# EAGLE design USB (EAGLE 7.1.0)
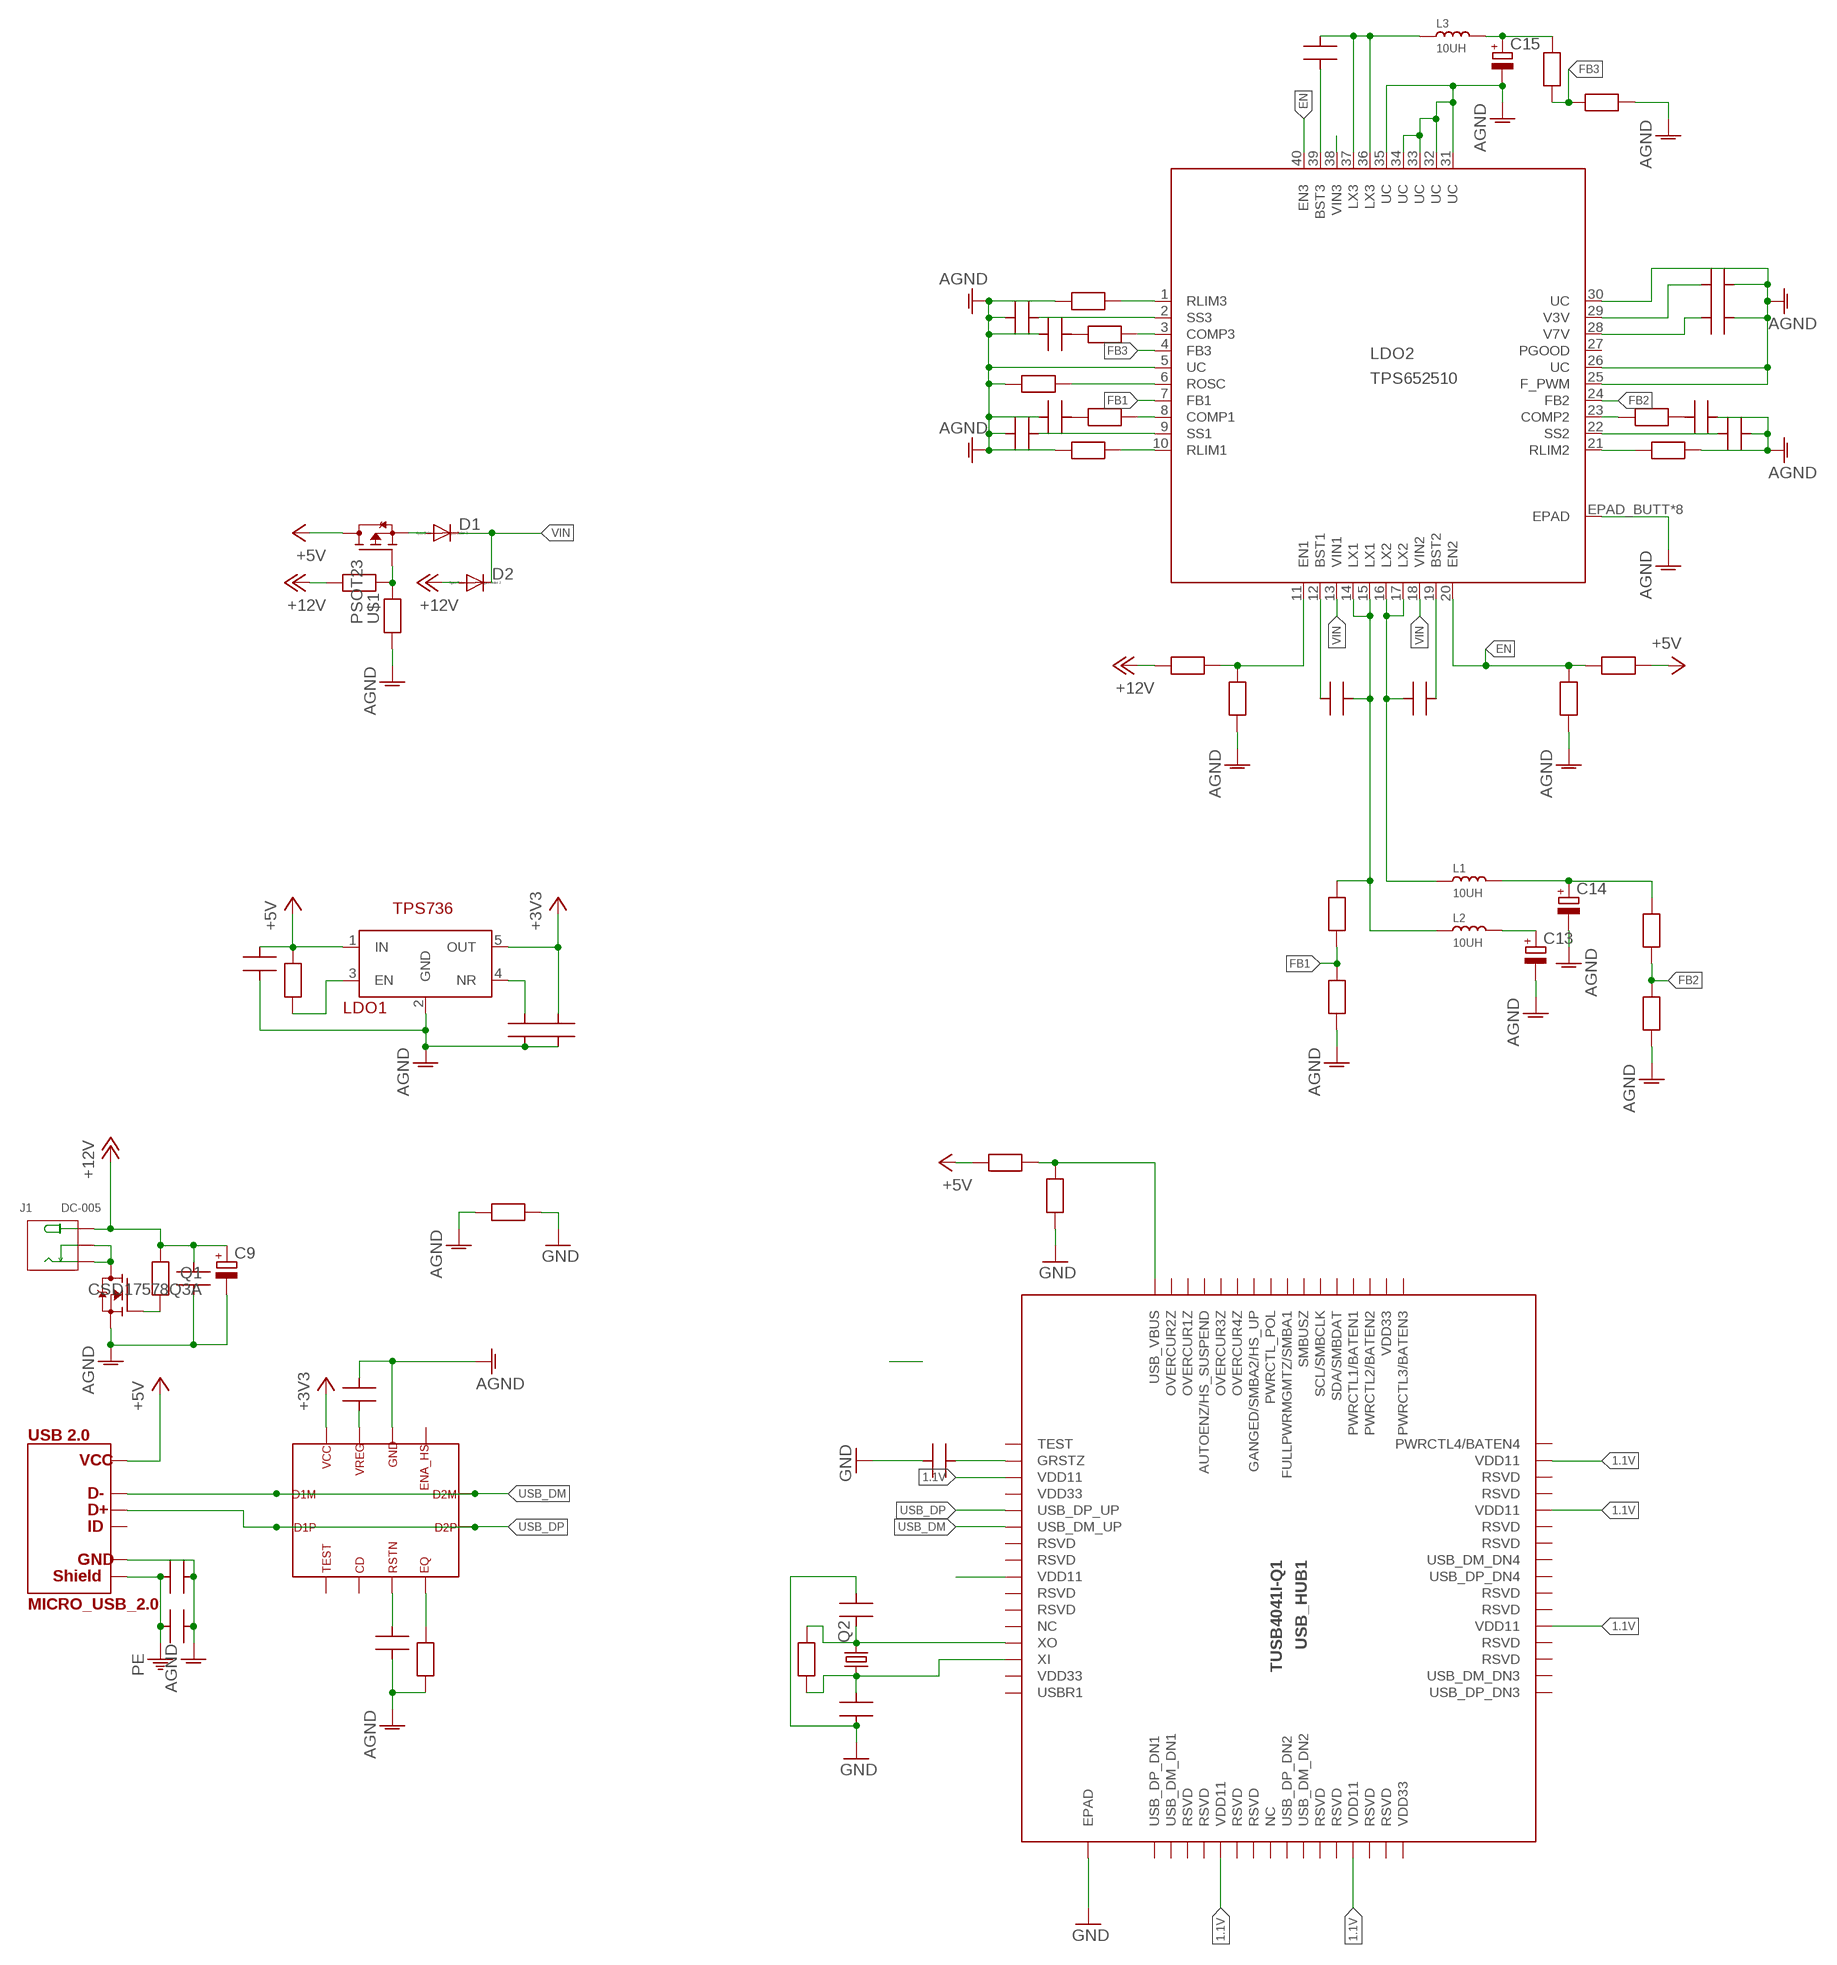
[diagram p0: schematic, sheet 1, part 1 of 2]
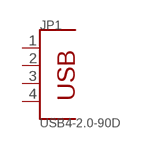
[diagram p1: schematic, sheet 1, part 2 of 2]

## Parts
C1  CAP0603  [C0603]
C2  CAP0603  [C0603]
C3  CAP0603  [C0603]
C4  CAP0603  [C0603]
C5  CAP0603  [C0603]
C6  CAP0603  [C0603]
C7  CAP0603  [C0603]
C8  CAP0603  [C0603]
C9  CPOL-EU153CLV-1014  [153CLV-1014]
C10  18p  CAP0603  [C0603]
C11  18p  CAP0603  [C0603]
C12  1u  CAP0603  [C0603]
C13  CPOL-EU153CLV-1010  [153CLV-1010]
C14  CPOL-EU153CLV-1010  [153CLV-1010]
C15  CPOL-EU153CLV-1010  [153CLV-1010]
C16  CAP0603  [C0603]
C17  CAP0603  [C0603]
C18  CAP0603  [C0603]
C19  CAP0603  [C0603]
C20  CAP0603  [C0603]
C21  CAP0603  [C0603]
C22  CAP0603  [C0603]
C23  CAP0603  [C0603]
C24  CAP0603  [C0603]
C25  CAP0603  [C0603]
C26  CAP0603  [C0603]
D1  DIODE-DO-214AC  [DO-214AC]
D2  DIODE-DO-214AC  [DO-214AC]
J1  DC-005  CONN-POWER-JACK-2.1MM(DC-005)  [DCJ3P-14.2X11.0X9.0MM]
JP1  USB4-2.0-90D  DIP-USB-A-TYPE-FMAL(4+2P-2.0-90D)  [USB4+2P-2.0-90D]
L1  10UH  SMD-INDUCTOR-10UH-20%(2P-6X6MM)'0630'  [SMD-2P-L6.0XW6.0XH3.0MM]
L2  10UH  SMD-INDUCTOR-10UH-20%(2P-6X6MM)'0630'  [SMD-2P-L6.0XW6.0XH3.0MM]
L3  10UH  SMD-INDUCTOR-10UH-20%(2P-6X6MM)'0630'  [SMD-2P-L6.0XW6.0XH3.0MM]
LDO1  TPS736  [SOT23-5]
LDO2  TPS652510  [PVQFN-40]
Q1  CSD17578Q3A  [VSONP8]
Q2  CRYSTALHC49S  [HC49/S]
R1  RES0603  [R0603]
R2  RES0603  [R0603]
R3  RES0603  [R0603]
R4  RES0603  [R0603]
R5  RES0603  [R0603]
R6  RES0603  [R0603]
R7  RES0603  [R0603]
R8  RES0603  [R0603]
R9  RES0603  [R0603]
R10  RES0603  [R0603]
R11  RES0603  [R0603]
R12  RES0603  [R0603]
R13  RES0603  [R0603]
R14  RES0603  [R0603]
R15  RES0603  [R0603]
R16  RES0603  [R0603]
R17  RES0603  [R0603]
R18  RES0603  [R0603]
R19  RES0603  [R0603]
R20  RES0603  [R0603]
R21  RES0603  [R0603]
R22  RES0603  [R0603]
R23  RES0603  [R0603]
R24  RES0603  [R0603]
R25  RES0603  [R0603]
R26  RES0603  [R0603]
U$1  PSOT23  [SOT23]
USB1  TUSB211QRWBRQ1  [X2QFN]
USB_CON1  MICRO_USB_2.0  [MICRO-USB5+4P-SMD-0.65]
USB_HUB1  TUSB4041I-Q1  [PQFP64]

## Nets
1.1V: USB_HUB1.19(VDD11) USB_HUB1.25(VDD11) USB_HUB1.37(VDD11) USB_HUB1.45(VDD11) USB_HUB1.53(VDD11) USB_HUB1.60(VDD11) USB_HUB1.63(VDD11)
+3V3: C6.2 LDO1.5(OUT) USB1.12
+5V: C4.2 LDO1.1(IN) R2.2 R5.2 R12.1 U$1.S USB_CON1.1
+12V: C1.2 C9.+ D2.A J1.+ R1.2 R8.2 R9.2
AGND: C1.1 C2.1 C3.1 C4.1 C5.1 C6.1 C7.2 C8.1 C9.- C13.- C14.- C15.- C19.2 C20.2 C21.2 C22.2 C23.1 C24.1 C25.1 C26.1 LDO1.2(GND) LDO2.5(UC) LDO2.25(F_PWM) LDO2.26(UC) LDO2.30(UC) LDO2.31(UC) LDO2.32(UC) LDO2.33(UC) LDO2.34(UC) LDO2.35(UC) LDO2.EPAD_BUTT(EPAD) LDO2.EPAD_TOP(EPAD) LDO2.EPAD_VIA1(EPAD) LDO2.EPAD_VIA2(EPAD) LDO2.EPAD_VIA3(EPAD) LDO2.EPAD_VIA4(EPAD) LDO2.EPAD_VIA5(EPAD) LDO2.EPAD_VIA6(EPAD) Q1.S1(S) Q1.S2(S) Q1.S3(S) R3.1 R7.1 R10.2 R11.2 R13.1 R15.2 R17.2 R19.2 R20.1 R21.1 R24.1 R26.2 USB1.10 USB_CON1.5
EN: LDO2.20(EN2) LDO2.40(EN3) R11.1 R12.2
FB1: LDO2.7(FB1) R16.2 R17.1
FB2: LDO2.24(FB2) R14.2 R15.1
FB3: LDO2.4(FB3) R18.2 R19.1
GND: C10.1 C11.2 C12.2 R6.2 R13.2 USB_HUB1.EPAD_BUTT(EPAD) USB_HUB1.EPAD_TOP(EPAD) USB_HUB1.EPAD_VIA1(EPAD) USB_HUB1.EPAD_VIA2(EPAD) USB_HUB1.EPAD_VIA3(EPAD) USB_HUB1.EPAD_VIA4(EPAD) USB_HUB1.EPAD_VIA5(EPAD)
N$1: LDO1.3(EN) R2.1
N$2: J1.-1(-) J1.-2(CDN) Q1.D1(D) Q1.D2(D) Q1.D3(D) Q1.D4(D) Q1.D5(D)
N$3: Q1.G R1.1
N$5: C5.2 LDO1.4(NR)
N$6: C7.1 USB1.11
N$7: C8.2 USB1.5
N$8: R3.2 USB1.6
N$9: C11.1 Q2.2 R4.2 USB_HUB1.29(XO)
N$10: C10.2 Q2.1 R4.1 USB_HUB1.30(XI)
N$11: D1.A U$1.D
N$12: R5.1 R6.1 USB_HUB1.16(USB_VBUS)
N$13: C12.1 USB_HUB1.18(GRSTZ)
N$17: R7.2 R8.1 U$1.G
N$18: LDO2.11(EN1) R9.1 R10.1
N$19: C16.2 LDO2.12(BST1)
N$20: C13.+ L2.2
N$21: C18.2 L3.1 LDO2.36(LX3) LDO2.37(LX3)
N$22: C16.1 L2.1 LDO2.14(LX1) LDO2.15(LX1) R16.1
N$23: C17.2 L1.1 LDO2.16(LX2) LDO2.17(LX2)
N$24: C14.+ L1.2 R14.1
N$25: C17.1 LDO2.19(BST2)
N$26: C15.+ L3.2 R18.1
N$27: C21.1 R22.1
N$28: LDO2.1(RLIM3) R21.2
N$29: C19.1 LDO2.2(SS3)
N$30: C18.1 LDO2.39(BST3)
N$31: LDO2.10(RLIM1) R20.2
N$32: C20.1 LDO2.9(SS1)
N$33: LDO2.8(COMP1) R22.2
N$34: C22.1 R23.1
N$35: C23.2 LDO2.29(V3V)
N$36: LDO2.3(COMP3) R23.2
N$37: LDO2.6(ROSC) R24.2
N$38: C24.2 LDO2.28(V7V)
N$39: C25.2 R25.2
N$40: LDO2.21(RLIM2) R26.1
N$41: LDO2.23(COMP2) R25.1
N$42: C26.2 LDO2.22(SS2)
PE: C2.2 C3.2 USB_CON1.P$1 USB_CON1.P$2 USB_CON1.P$3 USB_CON1.P$4
USB_DM: USB1.1 USB1.8 USB_CON1.2 USB_HUB1.22(USB_DM_UP)
USB_DP: USB1.2 USB1.7 USB_CON1.3 USB_HUB1.21(USB_DP_UP)
VIN: D1.C D2.C LDO2.13(VIN1) LDO2.18(VIN2) LDO2.38(VIN3)
Unconnected: JP1.1 JP1.2 JP1.3 JP1.4 JP1.SG1(GND) JP1.SG2(GND) LDO2.27(PGOOD) USB1.3 USB1.4 USB1.9 USB_CON1.4 USB_HUB1.1(PWRCTL3/BATEN3) USB_HUB1.3(PWRCTL2/BATEN2) USB_HUB1.4(PWRCTL1/BATEN1) USB_HUB1.5(SDA/SMBDAT) USB_HUB1.6(SCL/SMBCLK) USB_HUB1.7(SMBUSZ) USB_HUB1.8(FULLPWRMGMTZ/SMBA1) USB_HUB1.9(PWRCTL_POL) USB_HUB1.10(GANGED/SMBA2/HS_UP) USB_HUB1.11(OVERCUR4Z) USB_HUB1.12(OVERCUR3Z) USB_HUB1.13(AUTOENZ/HS_SUSPEND) USB_HUB1.14(OVERCUR1Z) USB_HUB1.15(OVERCUR2Z) USB_HUB1.17(TEST) USB_HUB1.23(RSVD) USB_HUB1.24(RSVD) USB_HUB1.26(RSVD) USB_HUB1.27(RSVD) USB_HUB1.28(NC) USB_HUB1.32(USBR1) USB_HUB1.33(USB_DP_DN1) USB_HUB1.34(USB_DM_DN1) USB_HUB1.35(RSVD) USB_HUB1.36(RSVD) USB_HUB1.38(RSVD) USB_HUB1.39(RSVD) USB_HUB1.40(NC) USB_HUB1.41(USB_DP_DN2) USB_HUB1.42(USB_DM_DN2) USB_HUB1.43(RSVD) USB_HUB1.44(RSVD) USB_HUB1.46(RSVD) USB_HUB1.47(RSVD) USB_HUB1.49(USB_DP_DN3) USB_HUB1.50(USB_DM_DN3) USB_HUB1.51(RSVD) USB_HUB1.52(RSVD) USB_HUB1.54(RSVD) USB_HUB1.55(RSVD) USB_HUB1.56(USB_DP_DN4) USB_HUB1.57(USB_DM_DN4) USB_HUB1.58(RSVD) USB_HUB1.59(RSVD) USB_HUB1.61(RSVD) USB_HUB1.62(RSVD) USB_HUB1.64(PWRCTL4/BATEN4)

## Power pins joined to a net without a drawn wire
VDD33: USB_HUB1.2(VDD33) USB_HUB1.20(VDD33) USB_HUB1.31(VDD33) USB_HUB1.48(VDD33)

## Library data of the parts
C1-C8 C10-C12 C16-C26 = My_RLC:CAP0603: Ceramic Capasitor SMD 0603
C9 C13-C15 = rcl:CPOL-EU: POLARIZED CAPACITOR, European symbol
D1 D2 = diode:DIODE-: DIODE
J1 = Seeed-OPL-Connector:CONN-POWER-JACK-2.1MM(DC-005): 320120003; MPN: DC-005
JP1 = Seeed-OPL-Connector:DIP-USB-A-TYPE-FMAL(4+2P-2.0-90D): 320010007
L1-L3 = Seeed-OPL-Inductor:SMD-INDUCTOR-10UH-20%(2P-6X6MM): 303010016; MPN: CSAB0630-100M
LDO1 = My_TI:TPS736: TPS73632DBVT Cap-Free, NMOS, 400-mA Low-Dropout Regulator with Reverse Current Protection Input Voltage Range of 1.7 V to 5.5 V Ultra-Low Dropout Voltage: 75 mV typ Low Noise: 30 μVRMS typ (10 Hz to 100 kHz) Dtasheet <http://www.ti.com/lit/ds/symlink/tps736.pdf>
LDO2 = My_TI:TPS652510: TPS652510 4.5-V TO 16-V INPUT, HIGH CURRENT, SYNCHRONOUS STEP DOWN THREE DC-DC CONVERTERS WITH INTEGRATED FET Continuous Loading: 3 A (Buck1), 2 A (Buck2 and 3) Synchronous Operation, 300-kHz – 2.2-MHz. Switching Frequency Set By External Resistor Datasheet <http://www.ti.com/lit/ds/symlink/tps652510.pdf>
Q1 = Mosfet_Logic:CSD17578Q3A: 30 V N-Channel NexFET™ Power MOSFETs. 14/142A
Q2 = crystal:CRYSTAL: CRYSTAL; OC_FARNELL: 1667008; OC_NEWARK: unknown
R1-R26 = My_RLC:RES0603: Resistor SMD 0603
U$1 = Mosfet_Logic:PSOT23
USB1 = My_TI:TUSB211QRWBRQ1: TUSB211 USB 2.0 High Speed Signal Conditioner Compatible with USB 2.0, OTG 2.0 and BC 1.2 Active Power Consumption of 55 mW (Typical) with 3.3-V Single Supply Datasheet <http://www.ti.com/lit/ds/symlink/tusb211-q1.pdf>
USB_CON1 = Interface:MICRO_USB_2.0: Micro USB 2.0
USB_HUB1 = My_TI:TUSB4041I-Q1: TUSB4041I-Q1 Four-Port USB 2.0 Hub Datasheet <http://www.ti.com/lit/ds/symlink/tusb4041i-q1.pdf>

## Board
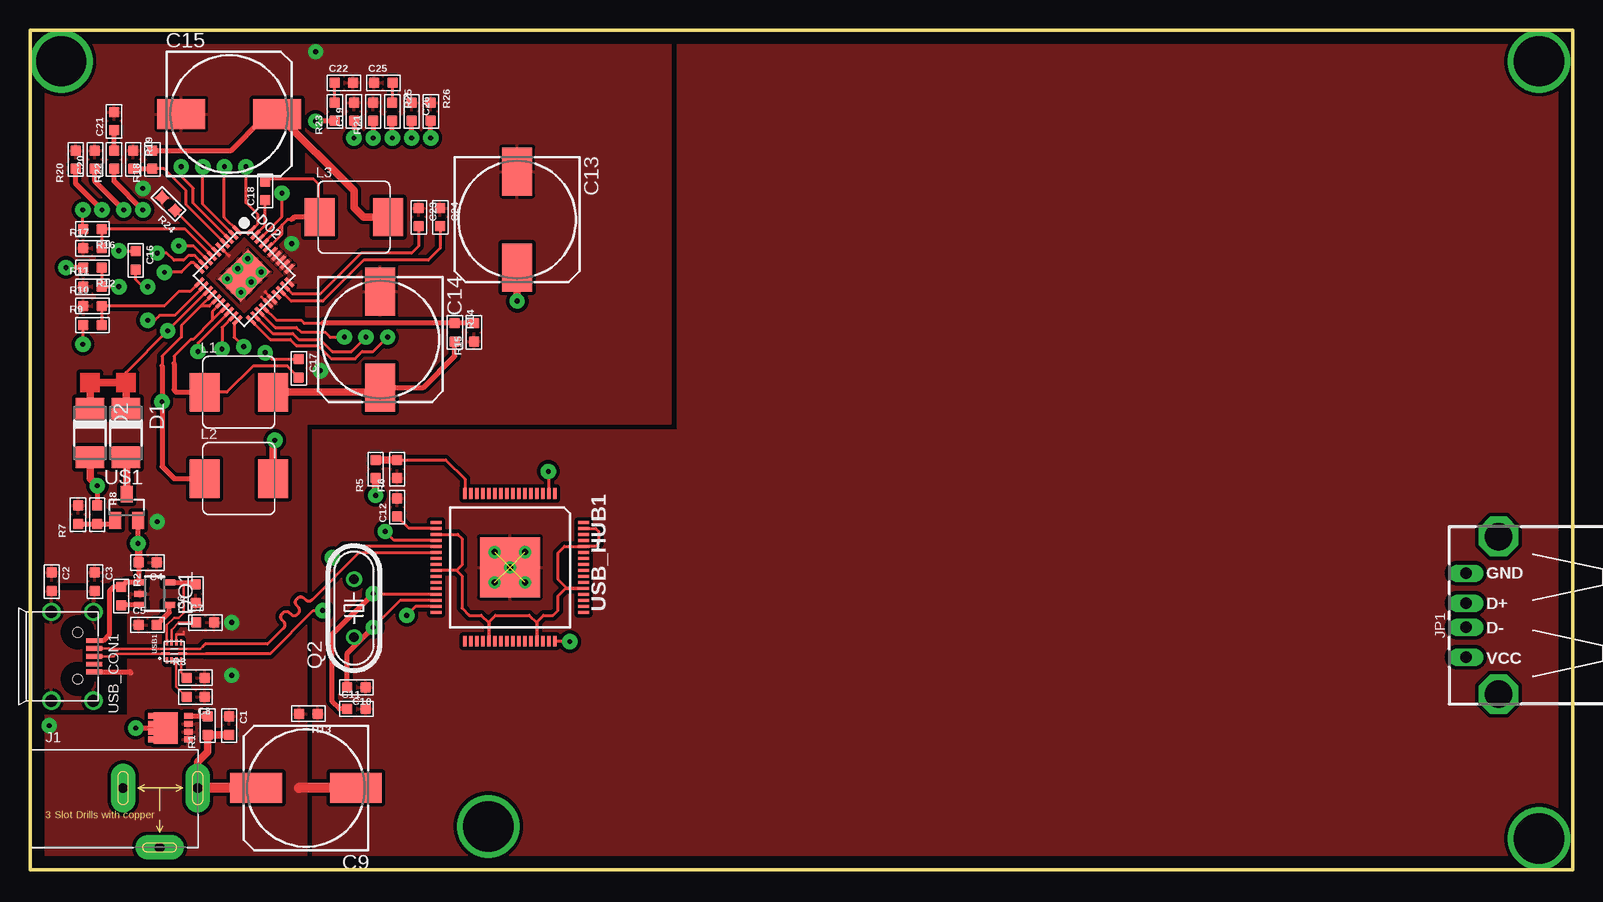
[diagram p2: board, top side]
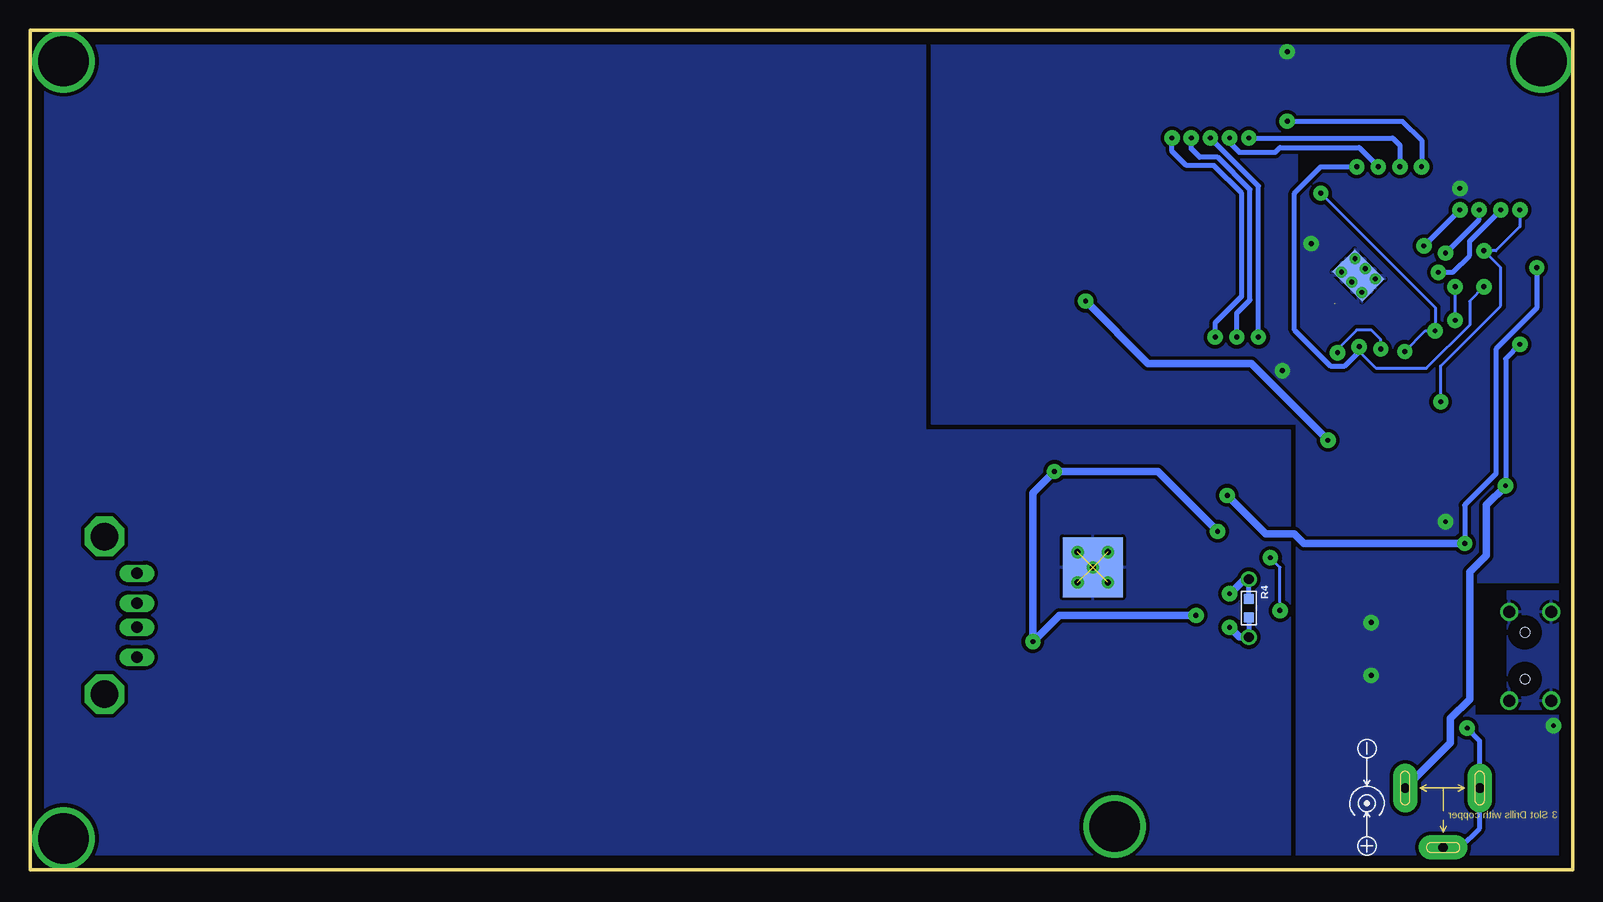
[diagram p3: board, bottom side, seen from below]

Size 128.6 x 70 mm. Coordinates in mm from the lower left corner, seen from the top.
Outline: 0,0 128.6,0 128.6,70 0,70 0,0
Copper layers (1*16): Top 0.035mm / dielectric 1.5mm / Bottom 0.035mm
Design rules "default": minimum track width 10mil, minimum drill 24mil, track to track 8mil, track to pad 8mil, pad to pad 8mil, via to via 8mil, smd to smd 8mil, copper to edge 40mil, drill to drill 8mil, minimum pad ring 10mil, minimum via ring 8mil, stop-mask expansion 4mil, vias tented up to drill 0mil, thermal gap 10mil

### Footprints (pad centres in the part's own frame; a part is rotated, then mirrored left to right if it is on the bottom)
C0603 = smd 0.889 x 0.889: 1 0,0.762; 2 0,-0.762
153CLV-1014 = smd 4.3 x 2.5: + 4.15,0; - -4.15,0
153CLV-1010 = smd 4 x 2.5: + 4,0; - -4,0
DO-214AC = smd 1.8 x 2.4: A 2.025,0; C -2.025,0
DCJ3P-14.2X11.0X9.0MM = drill 0.813 pad 2.032 long: + 3.175,0; -1 -3.048,0; -2 0,-4.953
USB4+2P-2.0-90D = drill 0.95 long: 1 -3.5,2.71; 2 -1,2.71; 3 1,2.71; 4 3.5,2.71 | drill 2.3 octagon: SG1 -6.57,0; SG2 6.57,0
SMD-2P-L6.0XW6.0XH3.0MM = smd 2.5 x 3.2: 1 -2.85,0; 2 2.85,0
SOT23-5 = smd 0.5 x 1: 1 -0.95,-1.2; 2 0,-1.2; 3 0.95,-1.2; 4 0.95,1.2; 5 -0.95,1.2
PVQFN-40 = smd 0.95 x 0.28: 1 -3.05,2.25; 2 -3.05,1.75; 3 -3.05,1.25; 4 -3.05,0.75; 5 -3.05,0.25; 6 -3.05,-0.25; 7 -3.05,-0.75; 8 -3.05,-1.25; 9 -3.05,-1.75; 10 -3.05,-2.25; 21 3.05,-2.25; 22 3.05,-1.75; 23 3.05,-1.25; 24 3.05,-0.75; 25 3.05,-0.25; 26 3.05,0.25; 27 3.05,0.75; 28 3.05,1.25; 29 3.05,1.75; 30 3.05,2.25 | smd 0.28 x 0.95: 11 -2.25,-3.05; 12 -1.75,-3.05; 13 -1.25,-3.05; 14 -0.75,-3.05; 15 -0.25,-3.05; 16 0.25,-3.05; 17 0.75,-3.05; 18 1.25,-3.05; 19 1.75,-3.05; 20 2.25,-3.05; 31 2.25,3.05; 32 1.75,3.05; 33 1.25,3.05; 34 0.75,3.05; 35 0.25,3.05; 36 -0.25,3.05; 37 -0.75,3.05; 38 -1.25,3.05; 39 -1.75,3.05; 40 -2.25,3.05 | smd 2.62 x 3.52 bottom: EPAD_BUTT 0,0 | smd 2.62 x 3.52: EPAD_TOP 0,0 | drill 0.4: EPAD_VIA1 -0.8,1.2; EPAD_VIA2 0.8,1.2; EPAD_VIA3 0.8,0; EPAD_VIA4 0.8,-1.2; EPAD_VIA5 -0.8,-1.2; EPAD_VIA6 -0.8,0
VSONP8 = smd 2.65 x 2.01: D1 -1,1.9 | smd 0.5 x 0.68: D2 0,3.03; D3 -0.65,3.03; D4 -1.3,3.03; D5 -1.95,3.03; G 0,0; S1 -1.95,0; S2 -1.3,0; S3 -0.65,0
HC49/S = drill 0.813: 1 -2.413,0; 2 2.413,0
R0603 = smd 0.889 x 0.889: 1 0,0.762; 2 0,-0.762
SOT23 = smd 1 x 1.4: D 0,1.1; G -0.95,-1.1; S 0.95,-1.1
X2QFN = smd 0.7 x 0.2: 1 -0.7,0.2; 2 -0.7,-0.2; 7 0.7,-0.2; 8 0.7,0.2 | smd 0.2 x 0.5: 3 -0.6,-0.75; 4 -0.2,-0.75; 5 0.2,-0.75; 6 0.6,-0.75; 9 0.6,0.75; 10 0.2,0.75; 11 -0.2,0.75; 12 -0.6,0.75
MICRO-USB5+4P-SMD-0.65 = smd 0.4 x 1.35: 1 -1.3,2.675; 2 -0.65,2.675; 3 0,2.675; 4 0.65,2.675; 5 1.3,2.675 | drill 1: P$1 -3.7,2.6; P$2 3.7,2.6; P$3 -3.7,-0.9; P$4 3.7,-0.9 | hole 0.8: -2,1.3; 1.9,1.3
PQFP64 = smd 0.9 x 0.27: 1 -6.15,3.75; 2 -6.15,3.25; 3 -6.15,2.75; 4 -6.15,2.25; 5 -6.15,1.75; 6 -6.15,1.25; 7 -6.15,0.75; 8 -6.15,0.25; 9 -6.15,-0.25; 10 -6.15,-0.75; 11 -6.15,-1.25; 12 -6.15,-1.75; 13 -6.15,-2.25; 14 -6.15,-2.75; 15 -6.15,-3.25; 16 -6.15,-3.75; 33 6.15,-3.75; 34 6.15,-3.25; 35 6.15,-2.75; 36 6.15,-2.25; 37 6.15,-1.75; 38 6.15,-1.25; 39 6.15,-0.75; 40 6.15,-0.25; 41 6.15,0.25; 42 6.15,0.75; 43 6.15,1.25; 44 6.15,1.75; 45 6.15,2.25; 46 6.15,2.75; 47 6.15,3.25; 48 6.15,3.75 | smd 0.27 x 0.9: 17 -3.75,-6.15; 18 -3.25,-6.15; 19 -2.75,-6.15; 20 -2.25,-6.15; 21 -1.75,-6.15; 22 -1.25,-6.15; 23 -0.75,-6.15; 24 -0.25,-6.15; 25 0.25,-6.15; 26 0.75,-6.15; 27 1.25,-6.15; 28 1.75,-6.15; 29 2.25,-6.15; 30 2.75,-6.15; 31 3.25,-6.15; 32 3.75,-6.15; 49 3.75,6.15; 50 3.25,6.15; 51 2.75,6.15; 52 2.25,6.15; 53 1.75,6.15; 54 1.25,6.15; 55 0.75,6.15; 56 0.25,6.15; 57 -0.25,6.15; 58 -0.75,6.15; 59 -1.25,6.15; 60 -1.75,6.15; 61 -2.25,6.15; 62 -2.75,6.15; 63 -3.25,6.15; 64 -3.75,6.15 | smd 5 x 5 bottom: EPAD_BUTT 0,0 | smd 5 x 5: EPAD_TOP 0,0 | drill 0.5: EPAD_VIA1 -1.27,1.27; EPAD_VIA2 1.27,1.27; EPAD_VIA3 0,0; EPAD_VIA4 -1.27,-1.27; EPAD_VIA5 1.27,-1.27

### Placement (x,y rotation side)
C1  16.6,12 0 top
C2  1.8,24 0 top
C3  5.4,24 0 top
C4  9.8,25.6 270 top
C5  9.8,20.4 90 top
C6  13.8,23 180 top
C7  14.6,20.6 90 top
C8  13.8,14.4 270 top
C9  23,6.8 180 top
C10  27.2,15.2 270 top
C11  27.2,13.4 90 top
C12  30.6,30.2 180 top
C13  40.6,54.2 270 top
C14  29.2,44.2 270 top
C15  16.6,63 0 top
C16  8.8,50.8 0 top
C17  22.4,41.8 0 top
C18  19.6,56.6 180 top
C19  27,63.2 180 top
C20  5.4,59.2 180 top
C21  7,62.4 180 top
C22  26.16,65.6 90 top
C23  32.4,54.4 0 top
C24  34.2,54.4 0 top
C25  29.44,65.6 90 top
C26  31.8,63.2 0 top
D1  8,36.4 270 top
D2  5,36.4 270 top
J1  10.8,6.8 0 top
JP1  122.4,21.2 90 top
L1  17.4,39.8 0 top
L2  17.4,32.6 0 top
L3  27,54.4 0 top
LDO1  10.4,23 270 top
LDO2  17.86,49.54 315 top
Q1  13.2,12.8 90 top
Q2  27,21.8 90 top
R1  14.8,12 0 top
R2  7.6,22.81 180 top
R3  13.8,16 270 top
R4  27,21.8 180 bottom
R5  28.8,33.4 0 top
R6  30.6,33.4 0 top
R7  4,29.6 0 top
R8  5.6,29.6 180 top
R9  5.2,45.4 270 top
R10  5.2,47 270 top
R11  5.2,48.6 270 top
R12  5.2,50.2 90 top
R13  23.2,13 90 top
R14  35.4,44.8 180 top
R15  37,44.8 0 top
R16  5.2,53.4 90 top
R17  5.2,51.8 270 top
R18  10.2,59.2 0 top
R19  8.6,59.2 180 top
R20  3.8,59.2 0 top
R21  28.6,63.2 0 top
R22  7,59.2 0 top
R23  25.4,63.2 0 top
R24  11.54,55.51 45 top
R25  30.2,63.2 180 top
R26  33.4,63.2 180 top
U$1  8.05,30.2 0 top
USB1  12,18.2 0 top
USB_CON1  2.68,17.79 270 top
USB_HUB1  40,25.2 270 top

### Tracks (layer width: path | path; a pad name or v marks a point on that pad's centre or on a via)
1.1V
  Top 0.254: USB_HUB1.19 35.65,27.95 36,27.6 36,25.4 35.55,24.95 | 35.55,24.95 USB_HUB1.25 | 35.55,24.95 36,24.5 36,21.8 36.6,21.2 37.6,21.2 38.25,20.55 USB_HUB1.37 38.25,20.65 38.8,21.2 41.6,21.2 42.25,20.55 USB_HUB1.45 42.25,20.65 42.8,21.2 43.6,21.2 44,21.6 44,22.8 44.65,23.45 USB_HUB1.53 44.75,23.45 44,24.2 44,26.4 44.55,26.95 USB_HUB1.60 47.15,26.95 47.4,27.2 47.4,28.2 47.15,28.45 USB_HUB1.63
+3V3
  Top 0.2: LDO1.5 12.45,23.95 12.8,23.6 12.8,21.4 12.4,21 12,21 11.4,20.4 USB1.12
  Top 0.406: LDO1.5 14.01,23.95 C6.2
+5V  (via drill 0.4 pad 1.27)
  Top 0.406: USB_CON1.1 6.09,19.09 6.6,19.6 6.6,23.2 6.97,23.57 R2.2 7.98,23.95 LDO1.1 9.04,24.11 C4.2 | v9,27.2 U$1.S | R12.1 v3,50.2
  Top 0.61: R5.2 v28.8,31.2 | v9,27.2 9.04,27.16 C4.2
  Bottom 0.406: v3,50.2 3,46.8 6.4,43.4 6.4,33 9,30.4 v9,27.2
  Bottom 0.61: v28.8,31.2 25.6,28 23.2,28 22.4,27.2 v9,27.2
+12V  (via drill 0.4 pad 1.27)
  Top 0.254: R9.2 4.4,45.36 v4.4,43.8
  Top 0.406: v5.6,32 R8.2
  Top 0.61: J1.+ 13.97,8.97 14.8,9.8 R1.2 C1.2 | D2.A 5,32.6 v5.6,32
  Top 0.813: C9.+ J1.+
  Bottom 0.406: v4.4,43.8 5.6,42.6 v5.6,32
  Bottom 0.61: J1.+ 10.2,10.57 10.2,12.6 8.6,14.2 8.6,24.8 7.2,26.2 7.2,30.4 v5.6,32
AGND  (via drill 0.4 pad 1.27)  (1 unrouted)
  Top 0.2: USB1.10 12.2,19.6 12.8,19.6 12.8,19.8
  Top 0.254: LDO2.26 19.6,48.15 19.6,48.2 | 19.87,47.17 19.28,47.76 | LDO2.EPAD_VIA2 LDO2.EPAD_VIA3 LDO2.EPAD_VIA4 | LDO2.EPAD_VIA1 LDO2.EPAD_VIA6 LDO2.EPAD_VIA5 | LDO2.5 16.55,51.2 16.6,51.2
  Top 0.406: USB_CON1.5 8.31,16.49 8.4,16.4
  Top 0.813: C9.- 22.4,6.8
  other vias: 1.6,12 16.8,20.6 16.8,16.2 10.6,29 23.8,68.2 24.2,41.6 9.4,56.8 21.8,52.2
  pour Top (isolate 0.305): 0,70 23,70 23,0 0,0 0,12.8 8.2,12.8 8.2,24 0,24
  pour Bottom (isolate 0.305): 0,0 23,0 23,70 0,70 0,24 8.2,24 8.2,12.8 0,12.8
  pour Top (isolate 0.305): 23,70 53.4,70 53.4,37.2 23,37.2
  pour Bottom (isolate 0.305): 53.4,70 23,70 23,37.2 53.4,37.2
EN  (via drill 0.4 pad 1.27)
  Top 0.254: R12.2 R11.1 v7.4,48.6 | LDO2.20 17,45.5 17,44.4 v17.8,43.6 | LDO2.40 19,53.87 19,54.6 18,55.6 v18,58.6
  Bottom 0.254: v7.4,48.6 8.6,47.4 8.6,45.4 12.2,41.8 16.4,41.8 17.8,43.2
  Bottom 0.406: v18,58.6 21,58.6 23.2,56.4 23.2,45 20.2,42 19,42 17.8,43.2 v17.8,43.6
FB1
  Top 0.254: R17.1 R16.2 12.94,53.4 LDO2.7
FB2
  Top 0.254: LDO2.24 20.54,45.8 22.6,45.8 22.84,45.56 24.36,45.56
  Top 0.406: R15.1 R14.2 24.36,45.56
FB3
  Top 0.254: LDO2.4 13,55.46 13,56.6 11.16,58.44 R18.2
  Top 0.406: R19.1 R18.2
GND  (4 unrouted)
  pour Top (isolate 0.305): 23.6,0 128.6,0 128.6,70 54,70 54,36.6 23.6,36.6
  pour Bottom (isolate 0.305): 23.6,0 128.6,0 128.6,70 54,70 54,36.6 23.6,36.6
N$1
  Top 0.406: LDO1.3 R2.1
N$2  (via drill 0.4 pad 1.27)
  Top 0.406: v8.8,11.8 Q1.D1 | Q1.D1 11,11.5 Q1.D4 Q1.D3 | Q1.D5 10.35,10.85 Q1.D1 | Q1.D2 10.3,12.8 Q1.D1
  Bottom 0.406: J1.-2 9.35,1.85 7.75,3.45 J1.-1 7.75,10.75 v8.8,11.8
N$3
  Top 0.406: Q1.G 14.76,12.8 R1.1
N$4  (via drill 4.2 pad 1.27)
  other vias: 38.2,3.6
N$5
  Top 0.406: C5.2 11.6,21.44 LDO1.4
N$6
  Top 0.2: C7.1 12.4,20.6 11.8,20 USB1.11
N$7
  Top 0.2: USB1.5 12.2,15.24 C8.2
N$8
  Top 0.2: USB1.6 12.6,16.44 R3.2
N$9  (via drill 0.4 pad 1.27)
  Top 0.254: USB_HUB1.29 28.65,22.95 v28.6,23
  Top 0.406: C11.1 25.8,13.4 25.2,14 25.2,19.6 v28.6,23
  Bottom 0.406: R4.2 Q2.2
  Bottom 0.61: Q2.2 27.39,24.21 v28.6,23
N$10  (via drill 0.4 pad 1.27)
  Top 0.254: USB_HUB1.30 30.85,22.45 v28.6,20.2
  Top 0.406: C10.2 26.44,18.04 v28.6,20.2
  Bottom 0.406: R4.1 Q2.1
  Bottom 0.61: Q2.1 27.79,19.39 v28.6,20.2
N$11
  Top 0.61: U$1.D 8.05,34.33 D1.A
N$12
  Top 0.254: R6.1 34.64,34.16 36.25,32.55 USB_HUB1.16
  Top 0.61: R5.1 R6.1
N$13
  Top 0.254: USB_HUB1.18 31.59,28.45 C12.1
N$14  (via drill 4.2 pad 1.27)
  other vias: 2.6,67.4
N$15  (via drill 4.2 pad 1.27)
  other vias: 125.8,2.6
N$16  (via drill 4.2 pad 1.27)
  other vias: 125.8,67.4
N$17
  Top 0.406: R7.2 R8.1 6.84,28.84 U$1.G
N$18
  Top 0.254: LDO2.11 13.34,48.2 12.4,48.2 11.2,47 R10.1 R9.1
N$19  (via drill 0.4 pad 1.27)
  Top 0.254: LDO2.12 12.04,46.2 10.8,46.2 10.4,45.8 v9.8,45.8 | v9.8,48.6 9.4,48.6 8.8,49.2 C16.2
  Bottom 0.254: v9.8,45.8 v9.8,48.6
N$20  (via drill 0.4 pad 1.27)
  Top 0.61: L2.2 20.25,35.65 v20.4,35.8 | v40.6,47.4 C13.+
  Bottom 0.61: v20.4,35.8 26.8,42.2 35.4,42.2 v40.6,47.4
N$21
  Top 0.254: 21.8,54.2 21.46,54.2 21,53.74 | 21,53.74 LDO2.37 | LDO2.36 19.88,51.88 21,53 21,53.74 | L3.1 24,54.55 24,57.2 23.6,57.6 19.84,57.6 C18.2
  Top 0.406: L3.1 22,54.4 21.8,54.2
N$22  (via drill 0.4 pad 1.27)
  Top 0.254: LDO2.14 14.23,46.97 | 14.23,46.97 12.6,45.34 12.6,44.4 11,42.8 11,42 | LDO2.15 14.94,46.97 14.23,46.97 | R16.1 4.4,53.44 v4.4,55 | v7.4,51.6 7.44,51.56 C16.1
  Top 0.406: 11,42 v11,39 11,33.6 12,32.6 L2.1
  Bottom 0.254: v4.4,55 4.4,53.6 6.4,51.6 v7.4,51.6 6,50.2 6,47 11,42 v11,39
N$23
  Top 0.254: LDO2.17 15.19,45.81 | 15.19,45.81 13.58,44.2 13.4,44.2 12,42.8 12,42.2 | LDO2.16 15.19,46.52 15.19,45.81 | C17.2 21.44,42 18.6,42 16.4,39.8 L1.1
  Top 0.406: 12,42.2 12,40 12.2,39.8 L1.1
N$24
  Top 0.406: C14.+ 32.8,40.2 35.4,42.8 R14.1
  Top 0.61: L1.2 28.8,39.8 C14.+
N$25  (via drill 0.4 pad 1.27)
  Top 0.254: LDO2.19 16,45.21 v16,43.4 | C17.1 20.14,42.56 v19.6,43.1
  Bottom 0.254: v16,43.4 16,44.2 16.8,45 18,45 19.6,43.4 v19.6,43.1
N$26
  Top 0.406: R18.1 16.76,59.96 19.4,62.6 20.2,62.6 C15.+
  Top 0.61: L3.2 27.8,54.4 27,55.2 27,56.6 C15.+
N$27
  Top 0.406: R22.1 C21.1
N$28  (via drill 0.4 pad 1.27)
  Top 0.254: LDO2.1 16.2,54.38 v16.2,58.6
  Top 0.406: R21.2 v28.6,61
  Bottom 0.406: v28.6,61 28.6,60.6 27.8,59.8 24.8,59.8 24.4,60.2 17.8,60.2 v16.2,58.6
N$29  (via drill 0.4 pad 1.27)
  Top 0.254: LDO2.2 14.4,55.48 v14.4,58.6
  Top 0.406: C19.1 v27,61
  Bottom 0.406: v27,61 15,61 14.4,60.4 v14.4,58.6
N$30
  Top 0.254: LDO2.39 19.6,53.76 C18.1
N$31  (via drill 0.4 pad 1.27)
  Top 0.254: LDO2.10 13.62,50.6 13.4,50.6 12.6,49.8 v11.2,49.8
  Top 0.406: v6,55 3.8,57.2 R20.2
  Bottom 0.406: v11.2,49.8 10,49.8 8.6,51.2 8.6,52.4 v6,55
N$32  (via drill 0.4 pad 1.27)
  Top 0.254: LDO2.9 13.72,51.2 13.2,51.2 12.8,50.8 12,50.8 11.4,51.4 v10.6,51.4
  Top 0.406: v7.8,55 5.4,57.4 C20.1
  Bottom 0.406: v10.6,51.4 7.8,54.2 v7.8,55
N$33  (via drill 0.4 pad 1.27)
  Top 0.254: LDO2.8 13.63,52 v12.4,52
  Top 0.406: v9.4,55 7,57.4 R22.2
  Bottom 0.406: v12.4,52 v9.4,55
N$34
  Top 0.254: R23.1 C22.1
N$35
  Top 0.254: C23.2 32.4,52 31.8,51.4 27.6,51.4 24.2,48 21.88,48 LDO2.29
N$36  (via drill 0.4 pad 1.27)
  Top 0.254: LDO2.3 13.6,55.57 13.6,56.8 12.6,57.8 v12.6,58.6 | R23.2 25.36,62.4
  Top 0.406: 25.36,62.4 v23.8,62.4
  Bottom 0.406: v23.8,62.4 14.2,62.4 12.6,60.8 v12.6,58.6
N$37
  Top 0.254: LDO2.6 R24.2
N$38
  Top 0.254: C24.2 34.2,51.8 33.2,50.8 27.8,50.8 24.4,47.4 21.77,47.4 LDO2.28
N$39
  Top 0.254: C25.2 R25.2
N$40  (via drill 0.4 pad 1.27)
  Top 0.254: LDO2.21 20.02,44.2 21.7,44.2 22.2,43.7 24,43.7 25.1,42.6 27.1,42.6 27.7,43.2 28.6,43.2 v29.8,44.4
  Top 0.406: v33.4,61 R26.1
  Bottom 0.406: v29.8,44.4 29.8,45.6 27.6,47.8 27.6,56.4 29.9,58.7 32.2,58.7 33.4,59.9 v33.4,61
N$41  (via drill 0.4 pad 1.27)
  Top 0.254: LDO2.23 20.43,45.2 22.2,45.2 22.6,44.8 24.6,44.8 25,44.4 v26.2,44.4
  Top 0.406: v30.2,61 R25.1
  Bottom 0.406: v26.2,44.4 26.2,57 v30.2,61
N$42  (via drill 0.4 pad 1.27)
  Top 0.254: v28,44.4 26.8,43.2 25.2,43.2 24.2,44.2 22.4,44.2 21.9,44.7 20.23,44.7 LDO2.22
  Top 0.406: v31.8,61 C26.2
  Bottom 0.406: v28,44.4 28,46.4 26.9,47.5 26.9,56.7 29.6,59.4 31.1,59.4 31.8,60.1 v31.8,61
PE
  pour Top (isolate 0.305): 0,23.2 5.4,23.2 5.4,13.4 0,13.4
  pour Bottom (isolate 0.305): 5.4,23.2 0,23.2 0,13.4 5.4,13.4
USB_DM
  Top 0.2: USB_CON1.2 6.56,18.44 6.6,18.4 USB1.1 USB1.8 14.2,18.4 14.4,18.6
  Top 0.254: USB_HUB1.22 27.45,26.45 23.5,22.5 arc-90 22.96,22.5 22.83,22.63 arc90 22.29,22.63 22.22,22.56 arc90 22.22,22.02 22.35,21.89 arc-90 22.35,21.35 22.29,21.29 arc-90 21.75,21.29 21.62,21.42 arc90 21.08,21.42 21.01,21.35 arc90 21.01,20.81 21.14,20.68 arc-90 21.14,20.14 19.8,18.8 14.6,18.8 14.4,18.6
USB_DP  (via drill 0.4 pad 1.27)
  Top 0.2: USB_CON1.3 6.99,17.79 7.2,18 USB1.2 USB1.7 14.6,18
  Top 0.254: USB_HUB1.21 26.15,26.95 v25.2,26 | v24.4,21.6 23.6,21.6 20,18 14.6,18
  Bottom 0.254: v24.4,21.6 24.4,25.2 v25.2,26
VDD33  (via drill 0.4 pad 1.27)
  Top 0.254: USB_HUB1.20 30.35,27.45 v29.6,28.2 | USB_HUB1.31 32.15,21.95 v31.4,21.2 | USB_HUB1.48 44.95,19.05 v45,19 | USB_HUB1.2 43.25,33.15 v43.2,33.2
  Bottom 0.61: v31.4,21.2 42.8,21.2 v45,19 45,31.4 v43.2,33.2 34.6,33.2 v29.6,28.2
VIN  (via drill 0.4 pad 1.27)
  Top 0.254: LDO2.13 v11.47,44.92 8,41.45 8,40.6 | LDO2.18 14,43.91 v14,43.2 | LDO2.38 21,54.45 v21,56.4
  Top 0.61: D2.C 5,40.6 8,40.6 D1.C
  Bottom 0.254: v14,43.2 12.28,44.92 v11.47,44.92 11.47,46.88 v21,56.4
(copper drawn outside any net)
  shapes: Top area x2